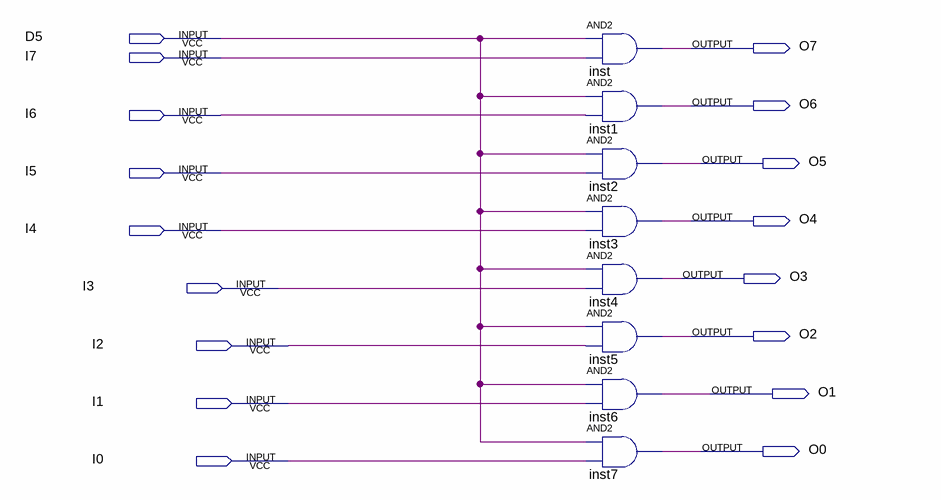
[diagram p0: schematic sheet]
// Quartus schematic AND2_8.bdf as structural Verilog: 8 symbols, 17 pins
module AND2_8 (
  input  D5,
  input  I7,
  input  I6,
  input  I5,
  input  I4,
  input  I3,
  input  I2,
  input  I1,
  input  I0,
  output O7,
  output O6,
  output O5,
  output O4,
  output O3,
  output O2,
  output O1,
  output O0
);

  and inst (O7, D5, I7);
  and inst1 (O6, D5, I6);
  and inst2 (O5, D5, I5);
  and inst3 (O4, D5, I4);
  and inst4 (O3, D5, I3);
  and inst5 (O2, D5, I2);
  and inst6 (O1, D5, I1);
  and inst7 (O0, D5, I0);
endmodule
